# EAGLE board ems_mbed (EAGLE 6.3)
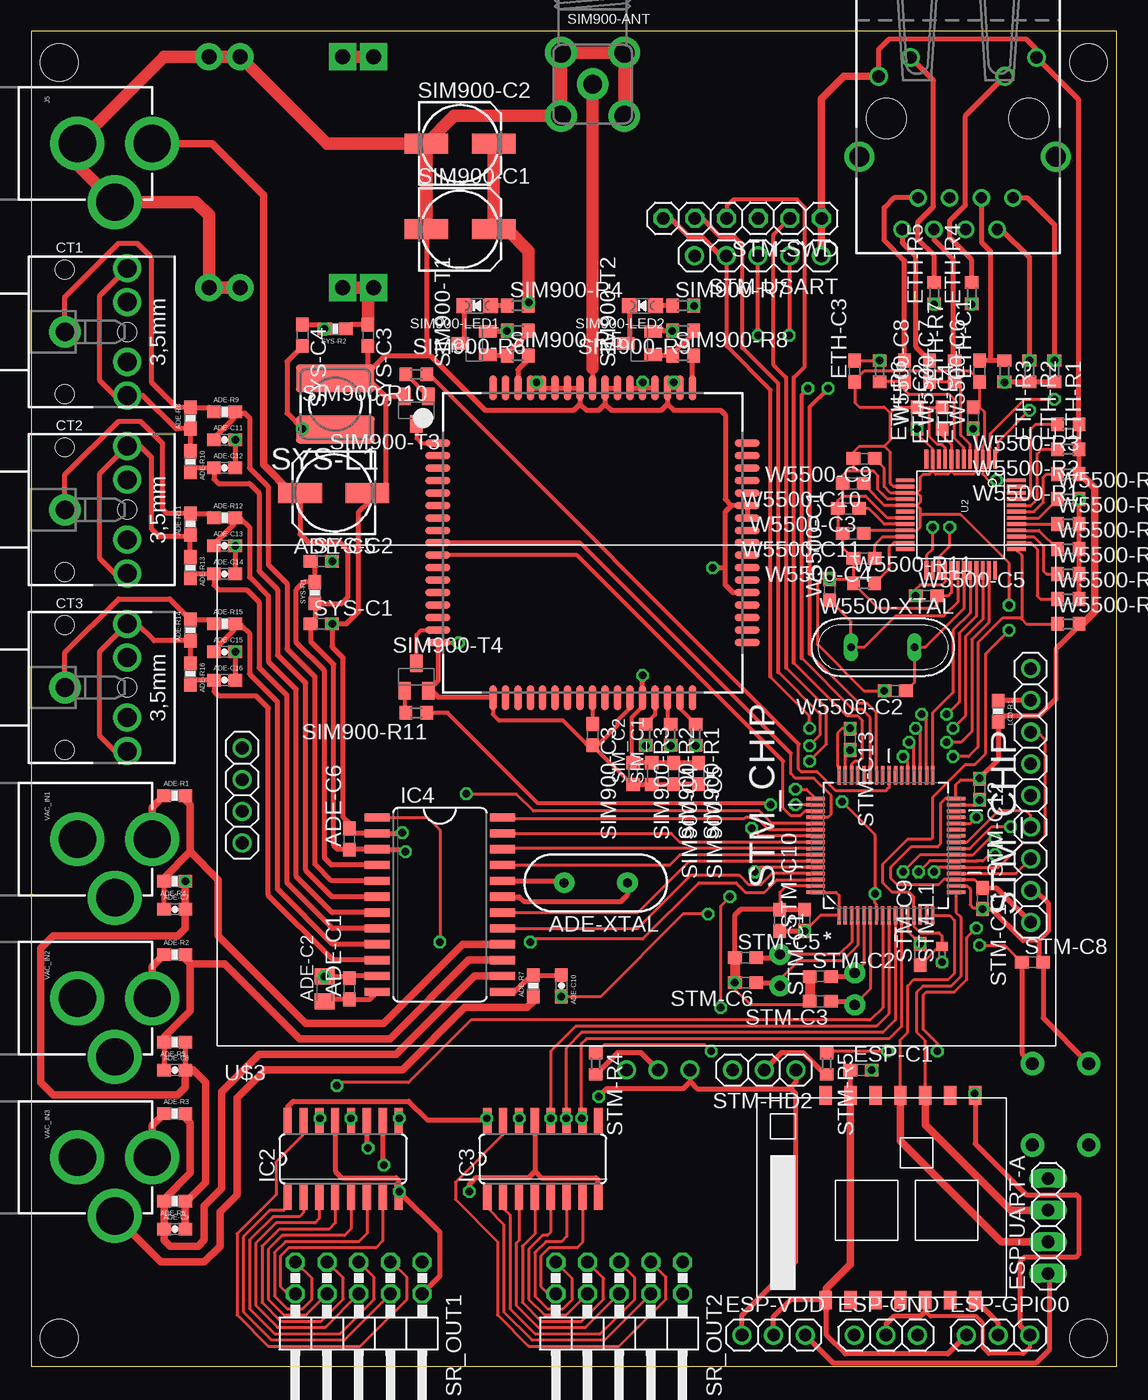
[diagram p2: board, top side]
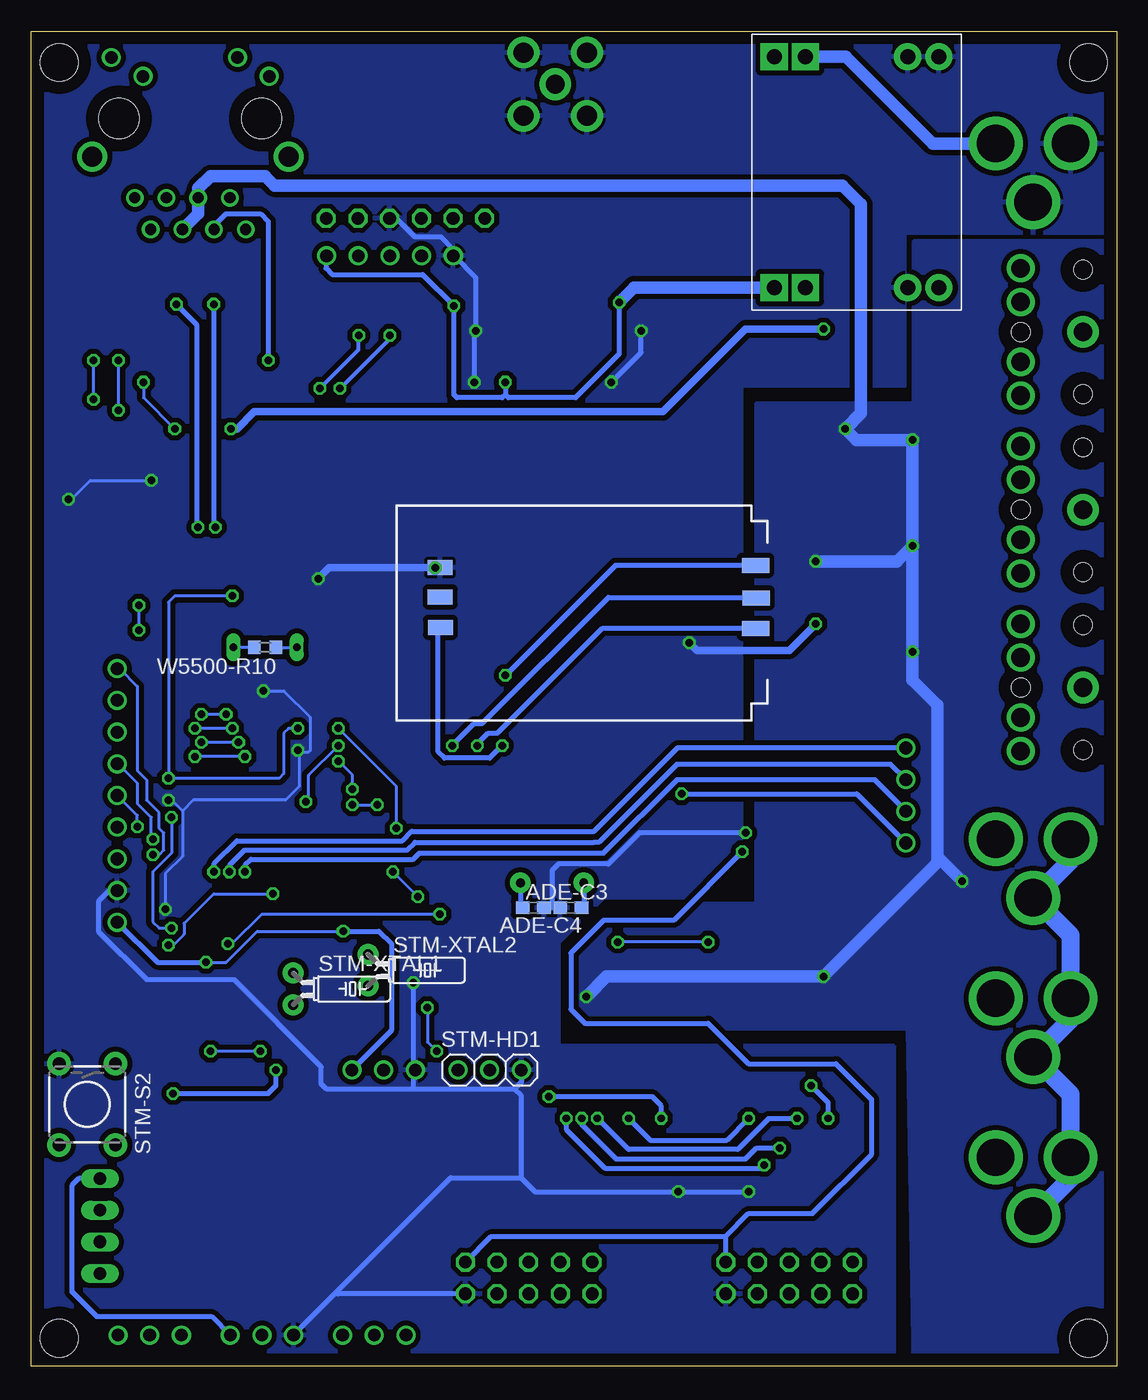
[diagram p3: board, bottom side, seen from below]

Size 87 x 107 mm. Coordinates in mm from the lower left corner, seen from the top.
Outline: 87,0 87,107 0,107 0,0 87,0
Copper layers (1*16): Top 0.035mm / dielectric 1.5mm / Bottom 0.035mm
Design rules "default": minimum track width 10mil, minimum drill 24mil, track to track 8mil, track to pad 8mil, pad to pad 8mil, via to via 8mil, smd to smd 8mil, copper to edge 40mil, drill to drill 8mil, minimum pad ring 10mil, minimum via ring 8mil, stop-mask expansion 4mil, vias tented up to drill 0mil, thermal gap 10mil
Net classes: 1 power: width 0.305 mm, drill 0.6 mm, clearance 0.254 mm; 2 gnd: width 0.254 mm, drill 0.6 mm, clearance 0.254 mm
Holes 3 mm at 2.25,2.25 84.75,2.25 2.25,104.5 84.75,104.5

## Footprints (pad centres in the part's own frame; a part is rotated, then mirrored left to right if it is on the bottom)
C0603 = smd 1.1 x 1: 1 -0.85,0; 2 0.85,0
C0805K = smd 1.3 x 1.6: 1 -1,0; 2 1,0
153CLV-0605 = smd 3.5 x 1.6: + 2.7,0; - -2.7,0
0603-CAP = smd 1.1 x 1: 1 -0.85,0; 2 0.85,0
0603-RES = smd 1.1 x 1: 1 -0.85,0; 2 0.85,0
HC49US = drill 0.7 pad 1.651: 1 -2.54,0; 2 2.54,0
STX3100 = drill 1.5 pad 2.54: 1 2.7,-0.1 | drill 1.5: 2 7.7,5; 3 7.7,2.3; 4 7.7,-2.5; 5 7.7,-5.2 | hole 1.5: 2.7,4.9; 2.7,-5.1; 7.7,-0.1
DCDCMODULE-SMALL = drill 1.2 pad 2.184: INM#1 1.8,15; INM#2 1.8,12.5; OUTM#1 20.3,15; OUTM#2 20.3,12.5 | drill 1.2 pad 2.184 square: INP#1 1.8,4.3; INP#2 1.8,1.8; OUTP#1 20.3,4.3; OUTP#2 20.3,1.8
ESP-07 = smd 1 x 1.5: ANT -5.59,10.47; CH_PD -3.59,10.47; GND 6.41,10.47; GPIO0 6.41,-5.93; GPIO2 4.41,-5.93; GPIO11 -3.59,-5.93; GPIO12 -1.59,-5.93; GPIO13 0.41,-5.93; GPIO15 2.41,-5.93; GPIO16 -1.59,10.47; NC 4.41,10.47; URXD 0.41,10.47; UTXD 2.41,10.47; VCC -5.59,-5.93
1X03 = drill 1.016: 1 -2.54,0; 2 0,0; 3 2.54,0
1X04 = drill 1.016 long: 1 -3.81,0; 2 -1.27,0; 3 1.27,0; 4 3.81,0
R0603 = smd 1 x 1.1: 1 -0.85,0; 2 0.85,0
RJ45_PULSEJACK = drill 0.9: 1 4.445,-6.35; 2 3.175,-8.89; 3 1.905,-6.35; 4 0.635,-8.89; 5 -0.635,-6.35; 6 -1.905,-8.89; 7 -3.175,-6.35; 8 -4.445,-8.89 | drill 1: 9 6.325,4.9; 10 3.785,3.38; 11 -3.785,4.9; 12 -6.325,3.38 | drill 1.6: P$5 -7.875,-3.05; P$6 7.875,-3.05 | hole 3.2: -5.715,0; 5.715,0
SIM900_SMT = smd 2 x 0.6: P$1 -12.4,8; P$2 -12.4,7; P$3 -12.4,6; P$4 -12.4,5; P$5 -12.4,4; P$6 -12.4,3; P$7 -12.4,2; P$8 -12.4,1; P$9 -12.4,0; P$10 -12.4,-1; P$11 -12.4,-2; P$12 -12.4,-3; P$13 -12.4,-4; P$14 -12.4,-5; P$15 -12.4,-6; P$16 -12.4,-7; P$17 -12.4,-8; P$35 12.4,-8; P$36 12.4,-7; P$37 12.4,-6; P$38 12.4,-5; P$39 12.4,-4; P$40 12.4,-3; P$41 12.4,-2; P$42 12.4,-1; P$43 12.4,0; P$44 12.4,1; P$45 12.4,2; P$46 12.4,3; P$47 12.4,4; P$48 12.4,5; P$49 12.4,6; P$50 12.4,7; P$51 12.4,8 | smd 0.6 x 2: P$18 -8,-12.4; P$19 -7,-12.4; P$20 -6,-12.4; P$21 -5,-12.4; P$22 -4,-12.4; P$23 -3,-12.4; P$24 -2,-12.4; P$25 -1,-12.4; P$26 0,-12.4; P$27 1,-12.4; P$28 2,-12.4; P$29 3,-12.4; P$30 4,-12.4; P$31 5,-12.4; P$32 6,-12.4; P$33 7,-12.4; P$34 8,-12.4; P$52 8,12.4; P$53 7,12.4; P$54 6,12.4; P$55 5,12.4; P$56 4,12.4; P$57 3,12.4; P$58 2,12.4; P$59 1,12.4; P$60 0,12.4; P$61 -1,12.4; P$62 -2,12.4; P$63 -3,12.4; P$64 -4,12.4; P$65 -5,12.4; P$66 -6,12.4; P$67 -7,12.4; P$68 -8,12.4
SO16 = smd 0.66 x 2.032: 1 -4.445,-3.073; 2 -3.175,-3.073; 3 -1.905,-3.073; 4 -0.635,-3.073; 5 0.635,-3.073; 6 1.905,-3.073; 7 3.175,-3.073; 8 4.445,-3.073; 9 4.445,3.073; 10 3.175,3.073; 11 1.905,3.073; 12 0.635,3.073; 13 -0.635,3.073; 14 -1.905,3.073; 15 -3.175,3.073; 16 -4.445,3.073
SOIC24 = smd 0.66 x 2.032: 1 -6.985,-5.029; 2 -5.715,-5.029; 3 -4.445,-5.029; 4 -3.175,-5.029; 5 -1.905,-5.029; 6 -0.635,-5.029; 7 0.635,-5.029; 8 1.905,-5.029; 9 3.175,-5.029; 10 4.445,-5.029; 11 5.715,-5.029; 12 6.985,-5.029; 13 6.985,5.029; 14 5.715,5.029; 15 4.445,5.029; 16 3.175,5.029; 17 1.905,5.029; 18 0.635,5.029; 19 -0.635,5.029; 20 -1.905,5.029; 21 -3.175,5.029; 22 -4.445,5.029; 23 -5.715,5.029; 24 -6.985,5.029
POWER_JACK_PTH = drill 2.997 pad 4.318: GND 0,7.7; GNDBREAK 4.7,10.7; PWR 0,13.7
SMA90_DIP = drill 1.5 pad 2.54: ANTENNA 0,0 | drill 1.6 pad 2.54: GND1 -2.54,2.54; GND2 2.54,2.54; GND3 -2.54,-2.54; GND4 2.54,-2.54
CHIPLED_0805_NOOUTLINE = smd 1.2 x 1.2: A 0,-1.05; C 0,1.05
SOT23-BEC = smd 1 x 1.4: B -0.95,-1.1; C 0,1.1; E 0.95,-1.1
C0603K = smd 1.05 x 1.08: 1 -0.875,0; 2 0.875,0
SIMHOLDER3 = smd 2.2 x 1.2: 1 0.95,4.81; 2 0.91,7.41; 3 0.95,9.86 | smd 2 x 1.2: 4 26.2,9.78; 5 26.22,7.34; 6 26.22,4.98
2X05/90 = drill 1.016 octagon: 1 -5.08,-6.35; 2 -5.08,-3.81; 3 -2.54,-6.35; 4 -2.54,-3.81; 5 0,-6.35; 6 0,-3.81; 7 2.54,-6.35; 8 2.54,-3.81; 9 5.08,-6.35; 10 5.08,-3.81
0402 = smd 0.7 x 0.9: 1 -0.65,0; 2 0.65,0
TACTILE-PTH = drill 1.016 pad 1.88: 1 -3.251,2.261; 2 3.251,2.261; 3 -3.251,-2.261; 4 3.251,-2.261
1X06 = drill 1.016 octagon: 1 -6.35,0; 2 -3.81,0; 3 -1.27,0; 4 1.27,0; 5 3.81,0; 6 6.35,0
PINHD5 = drill 1.016: 1 -5.08,0; 2 -2.54,0; 3 0,0; 4 2.54,0; 5 5.08,0
TC26H = drill 0.813 pad 1.676: 1 -1.27,0; 2 1.27,0
QFP50P1200X1200X160-64N = smd 1.473 x 0.279: 1 -5.613,3.759; 2 -5.613,3.251; 3 -5.613,2.743; 4 -5.613,2.261; 5 -5.613,1.753; 6 -5.613,1.245; 7 -5.613,0.762; 8 -5.613,0.254; 9 -5.613,-0.254; 10 -5.613,-0.762; 11 -5.613,-1.245; 12 -5.613,-1.753; 13 -5.613,-2.261; 14 -5.613,-2.743; 15 -5.613,-3.251; 16 -5.613,-3.759; 33 5.613,-3.759; 34 5.613,-3.251; 35 5.613,-2.743; 36 5.613,-2.261; 37 5.613,-1.753; 38 5.613,-1.245; 39 5.613,-0.762; 40 5.613,-0.254; 41 5.613,0.254; 42 5.613,0.762; 43 5.613,1.245; 44 5.613,1.753; 45 5.613,2.261; 46 5.613,2.743; 47 5.613,3.251; 48 5.613,3.759 | smd 0.279 x 1.473: 17 -3.759,-5.613; 18 -3.251,-5.613; 19 -2.743,-5.613; 20 -2.261,-5.613; 21 -1.753,-5.613; 22 -1.245,-5.613; 23 -0.762,-5.613; 24 -0.254,-5.613; 25 0.254,-5.613; 26 0.762,-5.613; 27 1.245,-5.613; 28 1.753,-5.613; 29 2.261,-5.613; 30 2.743,-5.613; 31 3.251,-5.613; 32 3.759,-5.613; 49 3.759,5.613; 50 3.251,5.613; 51 2.743,5.613; 52 2.261,5.613; 53 1.753,5.613; 54 1.245,5.613; 55 0.762,5.613; 56 0.254,5.613; 57 -0.254,5.613; 58 -0.762,5.613; 59 -1.245,5.613; 60 -1.753,5.613; 61 -2.261,5.613; 62 -2.743,5.613; 63 -3.251,5.613; 64 -3.759,5.613
POWER-CHOKE_WE-TPC = smd 6.3 x 2.2: 1 0,2.05; 2 0,-2.05
W5500 = smd 1.5 x 0.3: 1 -4.45,2.75; 2 -4.45,2.25; 3 -4.45,1.75; 4 -4.45,1.25; 5 -4.45,0.75; 6 -4.45,0.25; 7 -4.45,-0.25; 8 -4.45,-0.75; 9 -4.45,-1.25; 10 -4.45,-1.75; 11 -4.45,-2.25; 12 -4.45,-2.75; 25 4.45,-2.75; 26 4.45,-2.25; 27 4.45,-1.75; 28 4.45,-1.25; 29 4.45,-0.75; 30 4.45,-0.25; 31 4.45,0.25; 32 4.45,0.75; 33 4.45,1.25; 34 4.45,1.75; 35 4.45,2.25; 36 4.45,2.75 | smd 0.3 x 1.5: 13 -2.75,-4.45; 14 -2.25,-4.45; 15 -1.75,-4.45; 16 -1.25,-4.45; 17 -0.75,-4.45; 18 -0.25,-4.45; 19 0.25,-4.45; 20 0.75,-4.45; 21 1.25,-4.45; 22 1.75,-4.45; 23 2.25,-4.45; 24 2.75,-4.45; 37 2.75,4.45; 38 2.25,4.45; 39 1.75,4.45; 40 1.25,4.45; 41 0.75,4.45; 42 0.25,4.45; 43 -0.25,4.45; 44 -0.75,4.45; 45 -1.25,4.45; 46 -1.75,4.45; 47 -2.25,4.45; 48 -2.75,4.45
TFT_LCD_2.2 = drill 1.016: LCD_CS 31.6,-5.08; LCD_D/C 31.6,0; LCD_GND 31.6,-7.62; LCD_LED 31.6,7.62; LCD_MISO 31.6,10.16; LCD_MOSI 31.6,2.54; LCD_RESET 31.6,-2.54; LCD_SCK 31.6,5.08; LCD_VCC 31.6,-10.16; SD_CS -31.6,-3.81; SD_MISO -31.6,1.27; SD_MOSI -31.6,-1.27; SD_SCK -31.6,3.81
QS = drill 0.61 long: 1 -2.54,0; 2 2.54,0

## Placement (x,y rotation side)
ADE-C1  0.1uF  [C0603]  25.5,30.25 90 top
ADE-C2  10uF  [C0805K]  23.5,30.25 90 top
ADE-C3  22pF  [C0603]  46.75,36.75 0 bottom
ADE-C4  22pF  [C0603]  43.75,36.75 180 bottom
ADE-C5  10uF  [153CLV-0605]  24.25,70 180 top
ADE-C6  0.1uF  [C0603]  25.5,42.25 90 top
ADE-C7  33nF  [0603-CAP]  11.5,36.62 0 top
ADE-C8  33nF  [0603-CAP]  11.5,23.75 0 top
ADE-C9  33nF  [0603-CAP]  11.5,11 0 top
ADE-C10  33nF  [0603-CAP]  42.5,30.5 270 top
ADE-C11  33nF  [0603-CAP]  15.5,74.25 0 top
ADE-C12  33nF  [0603-CAP]  15.5,72 0 top
ADE-C13  33nF  [0603-CAP]  15.5,65.75 0 top
ADE-C14  33nF  [0603-CAP]  15.5,63.5 0 top
ADE-C15  33nF  [0603-CAP]  15.5,57.25 0 top
ADE-C16  33nF  [0603-CAP]  15.5,55 0 top
ADE-R1  81K  [0603-RES]  11.5,45.75 0 top
ADE-R2  81K  [0603-RES]  11.5,33 0 top
ADE-R3  81K  [0603-RES]  11.5,20.25 0 top
ADE-R4  1K  [0603-RES]  11.5,38.88 180 top
ADE-R5  1K  [0603-RES]  11.5,26 180 top
ADE-R6  1K  [0603-RES]  11.5,13.25 180 top
ADE-R7  1K  [0603-RES]  40.25,30.5 90 top
ADE-R8  33R  [0603-RES]  12.75,76 90 top
ADE-R9  1K  [0603-RES]  15.5,76.5 0 top
ADE-R10  1K  [0603-RES]  12.75,72.5 270 top
ADE-R11  33R  [0603-RES]  12.75,67.5 90 top
ADE-R12  1K  [0603-RES]  15.5,68 0 top
ADE-R13  1K  [0603-RES]  12.75,64 270 top
ADE-R14  33R  [0603-RES]  12.75,59 90 top
ADE-R15  1K  [0603-RES]  15.5,59.5 0 top
ADE-R16  1K  [0603-RES]  12.75,55.5 270 top
ADE-XTAL  10MHz  [HC49US]  45.25,38.75 180 top
CT1  100A  [STX3100]  0,83 0 top
CT2  100A  [STX3100]  0,68.75 0 top
CT3  100A  [STX3100]  0,54.5 0 top
DCDC-3.5V  DCDCMODULE_SMALL  [DCDCMODULE-SMALL]  29.25,106.75 270 bottom
ESP8266  ESP-07  [ESP-07]  69.25,11.25 0 top
ESP-C1  100nF  [C0603]  66.5,23.75 0 top
ESP-GND  [1X03]  68.5,2.5 0 top
ESP-GPIO0  [1X03]  77.5,2.5 0 top
ESP-UART-A  [1X04]  81.5,11.25 90 top
ESP-VDD  [1X03]  59.5,2.5 0 top
ETH-C1  22nF  [C0603]  76,79.75 90 top
ETH-C2  6.8nF  [C0603]  70,79.75 270 top
ETH-C3  10nF  [C0603]  66,79.75 90 top
ETH-C4  6.8nF  [C0603]  72,79.75 270 top
ETH-R1  49R9  [R0603]  82,79.75 270 top
ETH-R2  49R9  [R0603]  80,79.75 270 top
ETH-R3  10R  [R0603]  78,79.75 270 top
ETH-R4  330  [R0603]  75.38,86 90 top
ETH-R5  330  [R0603]  72.38,86 90 top
ETH-R6  49R9  [R0603]  68,79.75 270 top
ETH-R7  49R9  [R0603]  74,79.75 90 top
ETHERNET  [RJ45_PULSEJACK]  74.25,100 0 top
IC1  SIM900  [SIM900_SMT]  45,66 0 top
IC2  74HC595D  [SO16]  25,16.62 0 top
IC3  74HC595D  [SO16]  41,16.62 0 top
IC4  ADE7758RW  [SOIC24]  32.75,37 270 top
J5  POWER_JACKPTH  [POWER_JACK_PTH]  -4,98 270 top
LCD-R1  680R  [0603-RES]  77.5,52.5 270 top
SIM900-ANT  [SMA90_DIP]  45,102.75 0 top
SIM900-C1  100uF  [153CLV-0605]  34.38,91.12 0 top
SIM900-C2  100uF  [153CLV-0605]  34.38,98 0 top
SIM900-C3  4u7  [C0603]  45,50.62 270 top
SIM900-C4  100nF  [C0603]  51.5,47.5 270 top
SIM900-C5  22pF  [C0603]  53.5,47.5 270 top
SIM900-LED1  [CHIPLED_0805_NOOUTLINE]  35.75,85 90 top
SIM900-LED2  [CHIPLED_0805_NOOUTLINE]  49,85 90 top
SIM900-R1  22R  [R0603]  53.25,50.62 270 top
SIM900-R2  22R  [R0603]  51.25,50.62 270 top
SIM900-R3  22R  [R0603]  49.25,50.62 270 top
SIM900-R4  680R  [R0603]  39,85 0 top
SIM900-R5  1K  [R0603]  39,81 0 top
SIM900-R6  10K  [R0603]  39,83 180 top
SIM900-R7  680R  [R0603]  52.25,85 0 top
SIM900-R8  1K  [R0603]  52.25,81 0 top
SIM900-R9  10K  [R0603]  52.25,83 180 top
SIM900-R10  120R  [R0603]  30.88,79.5 180 top
SIM900-R11  120R  [R0603]  30.88,52.38 180 top
SIM900-T1  [SOT23-BEC]  35.5,82 90 top
SIM900-T2  [SOT23-BEC]  48.75,82 90 top
SIM900-T3  [SOT23-BEC]  30.88,76.62 180 top
SIM900-T4  [SOT23-BEC]  30.88,55.25 0 top
SIM_C1  100nF  [C0603K]  49.75,47.5 90 top
SIM_C2  22pF  [C0603K]  48.25,47.5 90 top
SIM_HOLDER  SIMHOLDER3  [SIMHOLDER3]  28,69 180 bottom
SR_OUT1  [2X05/90]  26.25,2 180 top
SR_OUT2  [2X05/90]  47.12,2 180 top
STM-C1  1uF  [C0603]  60,35.75 270 top
STM-C2  20pF  [C0603]  63.25,31.25 0 top
STM-C3  20pF  [C0603]  63.25,29.25 180 top
STM-C5  4.3pF  [C0603]  57.25,32.75 0 top
STM-C6  4.3pF  [C0603]  57.25,30.75 180 top
STM-C8  100nF  [C0603]  80.25,32.38 0 top
STM-C9  100nF  [C0603]  71.25,33 90 top
STM-C10  100nF  [C0603]  62,35.75 90 top
STM-C11  100nF  [C0603]  76.25,37.5 270 top
STM-C12  100nF  [C0603]  76,46.25 270 top
STM-C13  100nF  [C0603]  65.62,50.25 270 top
STM-HD1  BOOT0  [1X03]  50.25,23.75 0 bottom
STM-HD2  BOOT1  [1X03]  58.75,23.75 180 top
STM-L1  BLM15HB121SN1  [0402]  73,33 90 top
STM-R4  10k  [R0603]  45.25,24.25 270 top
STM-R5  10k  [R0603]  63.75,24.25 270 top
STM-S2  SWITCH-MOMENTARY-2PTH  [TACTILE-PTH]  82.5,21 270 bottom
STM-SWD  [1X06]  57,92 180 top
STM-USART  USART  [PINHD5]  58.25,89 180 top
STM-XTAL1  8MHz  [TC26H]  66,30.25 270 bottom
STM-XTAL2  32.768kHz  [TC26H]  60,31.75 270 bottom
STM_CHIP  STM32F103RBT6  [QFP50P1200X1200X160-64N]  68.5,41.75 90 top
SYS-C1  0.1uF  [C0603]  23.25,59.5 0 top
SYS-C2  0.1uF  [C0603]  23.25,64.5 0 top
SYS-C3  0.1uF  [C0603]  27,82.62 270 top
SYS-C4  0.1uF  [C0603]  21.75,82.62 270 top
SYS-L1  150Mhz  [POWER-CHOKE_WE-TPC]  24.38,77.12 180 top
SYS-R1  10R  [0603-RES]  22.75,62 90 top
SYS-R2  10R  [0603-RES]  24.38,83.12 180 top
U2  W5500  [W5500]  74.5,68.25 270 top
U$3  TFT_LCD_2.2  [TFT_LCD_2.2]  48.5,45.75 0 top
VAC_IN1  9V  [POWER_JACK_PTH]  -4,42.25 270 top
VAC_IN2  9V  [POWER_JACK_PTH]  -4,29.5 270 top
VAC_IN3  9V  [POWER_JACK_PTH]  -4,16.75 270 top
W5500-C1  18pF  [C0603]  64,62.25 90 top
W5500-C2  18pF  [C0603]  69.25,54.12 180 top
W5500-C3  4.7uF  [C0603]  65.5,68.75 180 top
W5500-C4  10nF  [C0603]  66.75,64.75 180 top
W5500-C5  100nF  [C0603]  71.75,61.75 0 top
W5500-C6  100nF  [C0603]  75.5,76 90 top
W5500-C7  100nF  [C0603]  73,76 90 top
W5500-C8  100nF  [C0603]  71,76 90 top
W5500-C9  100nF  [C0603]  66.75,72.75 180 top
W5500-C10  100nF  [C0603]  65.88,70.75 180 top
W5500-C11  100nF  [C0603]  65.88,66.75 180 top
W5500-R1  10k  [R0603]  83.12,71.5 180 top
W5500-R2  10k  [R0603]  83.12,73.5 180 top
W5500-R3  10k  [R0603]  83.12,75.5 180 top
W5500-R4  10k  [R0603]  83.12,69.5 0 top
W5500-R5  10k  [R0603]  83.12,67.5 0 top
W5500-R6  10k  [R0603]  83.12,65.5 0 top
W5500-R7  10k  [R0603]  83.12,63.5 0 top
W5500-R8  10k  [R0603]  83.12,61.5 0 top
W5500-R9  10k  [R0603]  83.12,59.5 0 top
W5500-R10  1M  [R0603]  68.25,57.62 180 bottom
W5500-R11  10k  [R0603]  66.75,62.75 0 top
W5500-XTAL  25MHz  [QS]  68.25,57.62 0 top

## Tracks (layer width: path | path; a pad name or v marks a point on that pad's centre or on a via)
+5V  (via drill 0.6)
  Top 0.406: 25.55,41.45 24.55,41.45 24.25,41.75 24.25,56.25 22.4,58.1 SYS-C1.1 22.75,59.85 SYS-R1.1 24.9,61.15 25.38,61.62 25.38,65.38 24.75,66 22.25,66 21.55,66.7 ADE-C5.+ | 25.55,41.45 IC4.3 29.8,41.45 v30,41.25 | 25.55,41.45 ADE-C6.1
  Top 0.61: ADE-C5.+ 20.88,70 18.62,72.25 18.62,93.88 14.5,98 J5.PWR
  Top 1.016: DCDC-3.5V.INP#2 DCDC-3.5V.INP#1
  Bottom 0.406: v30,41.25 35.5,35.75 41.12,35.75 43.75,33.12 43.75,28.62 42.62,27.5 32.75,27.5 29.5,24.25 22.5,24.25 19.62,21.38 19.62,17 24.38,12.25 29.5,12.25 31.33,10.42 | SR_OUT1.1 31.33,10.42 | 31.33,10.42 31.38,10.38 50.18,10.38 SR_OUT2.1
  Bottom 1.016: DCDC-3.5V.INP#1 21.7,104.95 14.75,98 J5.PWR
ACTLED  (via drill 0.6)
  Top 0.254: U2.27 72.75,64.88 73.62,65.75 v73.62,67.25
  Top 0.406: ETH-R4.1 v75.38,85.12
  Bottom 0.406: v75.38,85.12 73.75,83.5 73.75,67.38 v73.62,67.25
ADE_APCF  (via drill 0.6)
  Top 0.254: IC4.1 31.77,43.98 32.75,43 v32.75,34 | v40,34 40.25,34.25 49,34.25 53.5,38.75 56.5,38.75 57.25,38 58.75,38 59.75,39 STM_CHIP.62
  Bottom 0.254: v32.75,34 v40,34
ADE_CS
  Top 0.254: STM_CHIP.58 51.99,40.99 51.17,40.17 IC4.21
ADE_IRQ
  Top 0.254: IC4.18 48.62,36.37 52.75,40.5 STM_CHIP.59
ADE_MISO
  Top 0.254: 37.79,44 IC4.24 37.89,43.88 57.12,43.88 57.25,44 58.12,44 59.13,42.99 STM_CHIP.54
ADE_MOSI
  Top 0.254: STM_CHIP.57 37.83,41.5 IC4.22
ADE_SCK
  Top 0.254: IC4.23 51.28,42.72 52,42 STM_CHIP.56
ADE_VARCF
  Top 0.254: IC4.17 48.59,35.09 52.88,39.38 56.75,39.38 57.5,38.62 58.5,38.62 59.38,39.5 59.39,39.49 STM_CHIP.61
AGND  (via drill 0.6)
  Top 0.254: STM_CHIP.12 70.25,34.85 STM-C9.2 v71.25,33.88 | v54.25,36.25 52.25,36.25 45.62,29.62 v42.5,29.62 ADE-C10.2 | v16.38,65.75 ADE-C13.2 | v12.38,38.88 ADE-R4.1
  Top 0.406: ADE-C16.2 ADE-C15.2 v16.38,57.25 | ADE-C13.2 ADE-C14.2 | ADE-C12.2 ADE-C11.2 v16.38,74.25 | ADE-R5.1 ADE-C8.2 | IC4.11 25.69,31.29 ADE-C1.2 25.35,31.25 ADE-C2.2 | SYS-L1.1 21.75,75.08 v21.75,75.12 20.5,76.38 20.5,80.53 SYS-C4.2 | v24.12,64.5 SYS-C2.2
  Top 0.61: ADE-R4.1 ADE-C7.2 12.35,35.1 11.75,34.5 1.75,34.5 0.75,33.5 0.75,22.75 1.75,21.75 11.75,21.75 12.35,22.35 ADE-C8.2 13,23.75 14,22.75 14,14.75 12.5,13.25 ADE-R6.1 ADE-C9.2
  Bottom 0.254: v71.25,33.88 70.88,33.88 68.5,36.25 v54.25,36.25
  Bottom 0.406: v42.5,29.62 42.38,29.62
  Bottom 0.61: ETHERNET.5 73.6,93.65
  Bottom 1.016: ETHERNET.5 73.61,92.38 ETHERNET.4 | 73.6,93.65 73.6,94.4 72.62,95.38 68.25,95.38 67.5,94.62 22,94.62 20.5,93.12 20.5,76.38 v21.75,75.12 20.88,74.25 v16.38,74.25 v16.38,65.75 | v16.38,65.75 v16.38,57.25 16.38,55 14.38,53 14.38,40.88 | v24.12,64.5 17.62,64.5 v16.38,65.75 | 14.38,40.88 v12.38,38.88 | 14.38,40.88 14.38,40.38 ADE-C2.2 40.88,31.25 v42.5,29.62
  other vias: 23.5,31.25
  pour Bottom (isolate 0.406): -0.38,90.12 16.25,90.12 16.25,77.12 28.88,77.12 28.88,37 44.5,37 44.5,27.12 16.75,27.12 16.25,-0.25 -0.38,-0.25
AVDD
  Top 0.406: IC4.4 24.08,40.17 23.5,40.75 23.5,55.75 21.25,58 21.25,62.25 21.85,62.85 SYS-R1.2 22.75,64.15 SYS-C2.1
BOOT0  (via drill 0.6)
  Top 0.254: STM_CHIP.60 58.37,40 v58,39.62 | v55.25,28.75 55.25,36.88 v56,37.62 | v54.5,25.25 54,25.75 45.9,25.75 STM-R4.1
  Bottom 0.254: v58,39.62 v56,37.62 | v55.25,28.75 55.25,26 v54.5,25.25
BOOT1  (via drill 0.6)
  Top 0.254: STM_CHIP.28 75.25,43.5 v75.75,44 | STM-R5.1 63.85,25.1 | 64.03,25.38 STM-R5.1 | v68.62,25.25 63.9,25.25 STM-R5.1 | v72.62,25.25 72.62,25.88 71.5,27 71.5,29.75 71.75,30 74,30 75,31 75,34.38 v75.75,35.12
  Bottom 0.254: v68.62,25.25 v72.62,25.25 | v75.75,44 75.75,41.12 77.25,39.62 77.25,35.62 76.75,35.12 v75.75,35.12
DGND  (via drill 0.6)
  Top 0.254: STM_CHIP.18 75,38.5 75.25,38.25 75.25,37 75.5,36.75 76.15,36.75 STM-C11.2 v76.25,36.62 | STM_CHIP.31 75.6,45 STM-C12.2 v76,45.38 | STM_CHIP.63 60.5,38.5 60,38 STM-C1.1 | U2.14 69.12,70.5 68.88,70.75 68.88,73.25 68.38,73.75 | U2.16 68.62,69.5 67.88,70.25 67.88,71.38 67.5,71.75 65.88,71.75 | U2.19 68.62,68 66.88,69.75 65,69.75 | 68.38,73.75 66.38,73.75 65.9,73.28 W5500-C9.2 65.9,71.78 65.88,71.75 | 65,69.75 64.65,69.4 W5500-C3.2 64.65,67.12 W5500-C11.2 65.03,65.62 W5500-C4.2 W5500-R11.1 | U2.29 73.75,62 73.5,61.75 W5500-C5.2 72.6,60.98 72.38,60.75 67.9,60.75 W5500-R11.1 | STM_CHIP.47 65.25,49.02 STM-C13.2 v65.62,49.38 | STM-C6.2 56.4,30.23 57.62,29 62.15,29 | 65,69.75 65.03,69.78 W5500-C10.2 65.03,71.4 65.38,71.75 65.88,71.75 | U2.9 73.25,73.62 73,73.88 72.62,73.88 72,74.5 72,76.85 | 72,76.85 W5500-C8.2 70.97,76.88 69.38,76.88 68.88,76.38 | 72,76.85 W5500-C7.2 | W5500-C6.2 76.03,76.85 | 76.03,76.85 76.38,76.5 76.38,73.88 76.25,73.75 U2.3 76.25,71.5 76.75,71 v77.38,71 U2.48 | 76.03,76.85 76,76.88 ETH-C1.1 76,79 75.25,79.75 66.75,79.75 66,79 ETH-C3.1 66,77.25 66.38,76.88 68.38,76.88 68.88,76.38 | 68.38,73.75 68.88,74.25 68.88,76.38 | W5500-R11.1 65.55,63.1 W5500-C1.2 63.35,63.1 63,62.75 63,57.88 66.75,54.12 v68.38,54.12 W5500-C2.2 | v84,69.5 W5500-R4.2
  Top 0.305: IC1.P$29 48,52.75 47,51.75 47,51.38 45.5,49.88 45,49.88 | 45,49.88 SIM900-C3.2 48.02,46.75 SIM_C2.1 | IC1.P$18 37,52.25 37.5,51.75 42.62,51.75 44.5,49.88 45,49.88 | IC1.P$17 v34.25,58
  Top 0.406: IC2.13 24.37,15.63 24.88,15.12 29.25,15.12 29.45,14.93 29.45,14.12 | IC2.8 29.45,14.12 | IC3.13 40.37,15.63 | IC3.8 45.45,14.93 45.25,15.12 40.88,15.12 40.37,15.63 | 40.37,15.63 40.37,15.62 39.88,15.12 35.62,15.12 35.12,14.62 v35.12,14 | 29.45,14.12 29.57,14.25 v29.5,14 32.75,10.75 32.75,7.25 31.33,5.83 SR_OUT1.2 | STM-C10.2 STM-C1.1 56.85,36.6 56.38,36.12 56.38,32.77 STM-C5.1 | 49.77,46.77 SIM_C1.1 | IC1.P$65 40.5,78.4 | 40.5,78.4 IC1.P$64 IC1.P$63 IC1.P$62 IC1.P$61 44,77.12 | IC1.P$58 IC1.P$59 46,77.12 | IC1.P$45 IC1.P$46 56.12,69 | 51,77.12 IC1.P$54 51.5,78.4 | IC1.P$39 56.25,62 55.62,62.62 55.62,64 | IC1.P$17 32.6,54.92 SIM900-T4.E 32.1,54.15 32.62,53.62 36.98,53.62 IC1.P$18 | SIM900-C5.2 SIM900-C4.2 51.48,46.62 SIM_C1.1 | SIM_C2.1 SIM_C1.1 | SIM900-R9.2 v51.38,83 49.9,83 SIM900-T2.E | SIM900-T1.E 38.1,82.95 SIM900-R6.2 v38.12,83 | SYS-L1.2 26.95,79.17 27,79.12 | 27,79.62 SYS-C3.2 | 62.15,29 STM-C3.2 | U$3.LCD_GND 80.5,38.13 81.5,37.12 81.5,34.88 80.75,34.12 | 80.75,34.12 79.5,34.12 77,36.62 76.28,36.62 STM-C11.2 | 80.75,34.12 80.75,32.73 STM-C8.2 81.1,27.91 STM-S2.3 | STM-C6.2 v56.38,30.75 | W5500-R4.2 W5500-R5.2 W5500-R6.2 W5500-R7.2 W5500-R8.2 | SIM900-T3.E 28.4,77.72 | 28.4,77.72 28.4,70.28 28.12,70 ADE-C5.- 26.95,69.2 26.25,68.5 26.25,60.5 25.25,59.5 v24.12,59.5 SYS-C1.2 24.1,57.65 25,56.75 25,44 25.5,43.5 ADE-C6.2 25.88,42.72 IC4.2 29.72,42.72 v29.75,42.75 | IC1.P$53 51.98,78.4 | 51.98,78.4 51.5,78.4 | 51.98,78.4 52,78.38 | v51.5,78.88 51.5,78.4 | v40.5,78.88 40.5,78.4 | 27,79.12 27,79.62 | 27,79.62 28.38,81 31.62,81 | 31.62,81 32,81 36.38,76.62 43.5,76.62 44,77.12 | 28.4,77.72 27,79.12
  Top 0.406: SIM900-C1.- 31.67,81.05 31.62,81 | 44,77.12 44.5,76.62 45.5,76.62 46,77.12 | 46,77.12 46.5,76.62 50.5,76.62 51,77.12 | 51,77.12 51.5,76.62 55.25,76.62 55.62,76.25 55.62,69.5 56.12,69 | 56.12,69 55.62,68.5 55.62,64 | v54.62,64 55.62,64
  Top 0.61: v64,63.12 W5500-C1.2
  Top 0.813: STM-C5.1 STM-C6.2 | STM-C2.1 STM-C3.2
  Top 1.016: SIM900-ANT.GND4 SIM900-ANT.GND2 SIM900-ANT.GND1 SIM900-ANT.GND3 33.88,100.21 SIM900-C2.- | SIM900-C2.- SIM900-C1.- | DCDC-3.5V.OUTM#2 DCDC-3.5V.OUTM#1 14.25,92.25 13.2,93.3 J5.GNDBREAK 3.7,96.3 J5.GND 10.65,104.95 DCDC-3.5V.INM#1 DCDC-3.5V.INM#2 23.7,98 SIM900-C2.-
  Bottom 0.254: v77.38,71 82.25,71 83.75,69.5 v84,69.5 | v76,45.38 75.75,45.38 74.88,44.5 | 74.88,44.5 74.88,40.88 76.25,39.5 v76.25,36.62 | 74.88,44.5 74,45.38 66.62,45.38 65.5,46.5 65.5,49.25 | 65.5,49.25 64.75,49.25 64.62,49.38 64.62,52 66.75,54.12 v68.38,54.12 | 65.5,49.25 v65.62,49.38
  Bottom 0.406: v29.5,14 v35.12,14 46.62,14 47.75,15.12 | ADE-C4.2 45.38,36.75 | 45.38,36.75 ADE-C3.2 | SIM_HOLDER.6 54.6,64.02 v54.62,64 | 56.25,22.25 63.38,22.25 63.75,22.62 63.75,24 70.75,31 77.75,31 81.62,34.88 81.62,37.25 80.75,38.12 U$3.LCD_GND | 56.25,22.25 48.25,22.25 | STM-HD1.3 47.71,22.79 48.25,22.25 | 48.25,22.25 47.75,21.75 47.75,15.12 | v56.38,30.75 56.38,23.75 | 56.38,23.75 56.38,22.38 56.25,22.25 | STM-HD2.3 56.38,23.75 | STM-SWD.3 57.75,92 56.25,90.5 54.12,90.5 53.17,89.55 STM-USART.5 53.12,89 51.38,87.25 v51.38,83 51.5,82.88 v51.5,78.88 | v40.5,78.88 38.12,81.25 v38.12,83 | v29.75,42.75 38.25,42.75 40.75,40.25 44.75,40.25 45.25,39.75 45.25,36.88 45.38,36.75 | 47.75,15.12 53.38,15.12 62.56,5.94 | ESP-GND.1 65.96,2.54 62.56,5.94 | SR_OUT2.2 62.44,5.81 62.56,5.94
  Bottom 0.61: v64,63.12 63.12,64 v54.62,64 | v24.12,59.5 26.25,57.38 33.62,57.38 v34.25,58
  pour Bottom (isolate 0.406): 0,107.38 0,107.5 87.5,107.5 87.5,-0.38 17.88,-0.38 17.88,25.62 18,25.62 44.75,25.62 44.75,34 41.12,37.62 30.12,37.62 30.12,78.62 17,78.62 17,90.88 0,90.88
ESP_GPIO0
  Top 0.406: ESP-GPIO0.2 77.5,3.48 ESP8266.GPIO0
ESP_RX
  Top 0.254: ESP8266.URXD 69.66,26.16 70.25,26.75 70.25,30.5 70.75,31 73.5,31 74,31.5 74,35.75 73.61,36.14 STM_CHIP.16
  Top 0.61: ESP8266.URXD 69.66,18.09 77.75,10 81.48,10 ESP-UART-A.2
ESP_TX
  Top 0.254: STM_CHIP.17 74.11,36.39 74.5,36 74.5,31.25 73.75,30.5 71.5,30.5 71,30 71,26.75 71.66,26.09 ESP8266.UTXD
  Top 0.61: ESP8266.UTXD 71.66,19.34 78.5,12.5 81.48,12.5 ESP-UART-A.3
ETH_CS
  Top 0.254: U2.32 75.25,60.38 73.88,59 73.88,54 72.26,52.38 STM_CHIP.33
ETH_MISO  (via drill 0.6)
  Top 0.254: STM_CHIP.35 71.24,50.76 v70.88,51.12 | U2.34 76.25,59.88 74.88,58.5 74.88,52.12 v73.88,51.12
  Bottom 0.254: v70.88,51.12 v73.88,51.12
ETH_MOSI  (via drill 0.6)
  Top 0.254: STM_CHIP.36 70.76,49.61 v70.38,50 | U2.35 76.75,59.62 75.38,58.25 75.38,50.88 74.5,50 v73.38,50
  Bottom 0.254: v70.38,50 v73.38,50
ETH_RSTN  (via drill 0.6)
  Top 0.254: STM_CHIP.37 70.25,48.5 v69.88,48.88 | v73.88,48.88 75.12,48.88 75.88,49.62 75.88,58 77.88,60 79.38,60 | U2.37 78.95,65.42 79.38,65 79.38,60 | 79.38,60 79.38,59.88 79.75,59.5 W5500-R9.1
  Bottom 0.254: v69.88,48.88 v73.88,48.88
ETH_SCK  (via drill 0.6)
  Top 0.254: U2.33 75.75,60.12 74.38,58.75 74.38,53.25 v73.38,52.25 | STM_CHIP.34 71.75,51.87 v71.38,52.25
  Bottom 0.254: v71.38,52.25 v73.38,52.25
GESP  (via drill 0.6)
  Top 0.305: 71.66,4.41 72.07,4 75.75,4 76.25,3.5 76.25,1.5 76.75,1 79.5,1 80.04,1.54 ESP-GPIO0.3
  Top 0.406: ESP8266.GPIO15 71.66,4.41 71.25,4 69.12,4 68.5,3.38 ESP-GND.2 | v67.38,23.75 ESP-C1.2 | v75.62,21.88 75.62,21.75 ESP8266.GND 75.66,17.84 79.75,13.75 83.75,13.75 84,13.5 84,9 83.75,8.75 79.62,8.75 79.25,8.38 79.25,3.29 ESP-GPIO0.3
  Bottom 0.406: v75.62,21.88 68,21.88 67.38,22.5 v67.38,23.75
GEXT
  Bottom 0.406: ESP-UART-A.4 83.19,15.06 83.75,14.5 83.75,6 81.75,4 72.54,4 ESP-GND.3
IBN
  Top 0.406: CT2.5 6.7,63.55 5.5,64.75 5.5,71.55 CT2.2 8.75,73.75 9.62,72.88 9.62,67.12 10.25,66.5 12.65,66.5 ADE-R11.1 ADE-R13.1
ICN
  Top 0.406: ADE-R16.1 ADE-R14.1 9.85,58.15 8.5,59.5 CT3.2 5.5,57.3 5.5,50.5 6.7,49.3 CT3.5
LCD_CS
  Top 0.254: STM_CHIP.20 78.92,39.49 U$3.LCD_CS
LCD_D/C  (via drill 0.6)
  Top 0.254: STM_CHIP.24 75.25,41.5 77,43.25 v78.5,43.25
  Bottom 0.254: v78.5,43.25 78.5,44.15 U$3.LCD_D/C
LCD_LED
  Top 0.406: U$3.LCD_LED 77.52,53.37 LCD-R1.1
LCD_MISO  (via drill 0.6)
  Top 0.254: v77.25,41 76.75,41 76.25,40.5 75.76,40.5 75.75,40.51 STM_CHIP.22 72,40.51 v71.12,39.62
  Bottom 0.254: v77.25,41 76.75,41 76.38,41.38 76.38,42.75 76.75,43.12 76.75,44.38 77.75,45.38 77.75,47 78.5,47.75 78.5,54.5 79.91,55.91 U$3.LCD_MISO
  Bottom 0.406: U$3.SD_MISO 18.12,48.25 35.25,48.25 41.5,42 41.62,42 41.88,42 56.25,42 56.88,41.38 69.88,41.38 71.12,40.12 v71.12,39.62
LCD_MOSI  (via drill 0.6)
  Top 0.254: v77.25,42.25 76.75,42.25 75.49,40.99 STM_CHIP.23 71.24,40.99 v69.88,39.62
  Bottom 0.254: U$3.LCD_MOSI 80.04,48.29 78.5,46.75 78.5,45.12 77.38,44 77.38,42.38 v77.25,42.25
  Bottom 0.406: U$3.SD_MOSI 16.9,44.52 19.38,47 35.25,47 41.12,41.12 55.88,41.12 56.38,40.62 69.38,40.62 69.88,40.12 v69.88,39.62
LCD_RESET
  Top 0.254: STM_CHIP.25 75,42 77.5,44.5 79.75,44.5 80.1,44.15 U$3.LCD_RESET
LCD_SCK  (via drill 0.6)
  Top 0.254: U$3.LCD_SCK 80.67,50.83 81.25,50.25 81.25,42.5 80.75,42 79.5,42 77.5,40 STM_CHIP.21 72.75,40 v72.38,39.62
  Bottom 0.406: U$3.SD_SCK 35.19,49.56 41.88,42.88 56.5,42.88 57.25,42.12 70.5,42.12 72.38,40.25 v72.38,39.62
LINKLED  (via drill 0.6)
  Top 0.254: U2.25 71.75,65 72.25,65.5 v72.25,67.25 | ETH-R5.1 v72.38,85.12
  Bottom 0.406: v72.38,85.12 72.38,67.38 v72.25,67.25
N$1
  Top 0.254: STM_CHIP.3 65.76,34.01 64.75,33 60.02,33 STM-XTAL2.1
  Top 0.406: STM-C5.2 59.73,32.75 STM-XTAL2.1
N$2
  Top 0.254: STM_CHIP.4 66.25,36.13 66.25,33.75 65,32.5 61.5,32.5 60,31 STM-XTAL2.2
  Top 0.406: STM-C6.1 59.73,30.75 STM-XTAL2.2
N$3
  Top 0.305: IC1.P$31 50,52.23 SIM900-R3.1
N$5
  Top 0.406: STM-HD1.2 48.88,25.12 46.98,25.12 STM-R4.2
N$6
  Top 0.254: STM_CHIP.5 66.75,32.27 STM-XTAL1.1
  Top 0.406: STM-C2.2 65.73,31.25 STM-XTAL1.1
N$7
  Top 0.254: STM_CHIP.6 67.25,30.23 STM-XTAL1.2
  Top 0.406: STM-C3.1 65.73,29.25 STM-XTAL1.2
N$8
  Top 0.305: IC1.P$32 51,51.73 SIM900-R2.1
N$10
  Top 0.61: ADE-R3.2 12.35,19.9 12.75,19.5 12.75,15.5 10.65,13.4 ADE-R6.2 ADE-C9.1 10.65,10.1 11.12,9.62 13.38,9.62 13.88,10.12 13.88,12.88 15.25,14.25 15.25,22 18.25,25 29.25,25 35.53,31.29 IC4.14
N$11
  Top 0.406: ETH-R4.2 75.38,88.69 73.62,90.44 73.62,91.81 74.88,93.06 74.88,100.22 ETHERNET.10
N$12
  Top 0.406: ETH-R5.2 72.38,89 71.06,90.31 71.06,91.69 72.31,92.94 72.31,103.05 ETHERNET.11
N$13
  Top 0.305: IC1.P$33 52,52.73 SIM900-R1.1
N$14
  Top 0.305: IC1.P$26 SIM900-C3.1
N$15
  Top 0.406: 45,80 IC1.P$60
  Top 1.016: SIM900-ANT.ANTENNA 45,80
N$16
  Top 0.406: SIM900-R4.1 SIM900-LED1.A
N$17
  Top 0.406: SIM900-LED1.C 34.7,82.3 SIM900-T1.C
N$18
  Top 0.406: SIM900-T1.B 38.1,81.05 SIM900-R5.1 38.15,81.15 39.85,82.85 SIM900-R6.1
N$19
  Top 0.406: SIM900-R7.1 SIM900-LED2.A
N$20
  Top 0.406: SIM900-LED2.C 47.95,82.3 SIM900-T2.C
N$21
  Top 0.406: SIM900-T2.B 51.35,81.05 SIM900-R8.1 51.4,81.15 53.1,82.85 SIM900-R9.1
N$22
  Top 0.406: ETH-C2.1 70,88.62 68.38,90.25 68.38,92.88 69.15,93.65 ETHERNET.7
N$23
  Top 0.406: 76.16,80.75 ETH-C1.2 76.88,80.6 | ETH-R3.1 76.88,80.6 | ETHERNET.3 76.16,90.09 76.88,89.38 76.88,80.6
N$24
  Top 0.406: 14.75,57.35 ADE-C15.1 14.65,57.4 16.25,59 16.25,59.4 ADE-R15.2 16.35,59.35 16.9,59.35 17.5,58.75 17.5,55.5 19.75,53.25 19.75,38.25 24.17,33.83 IC4.9
N$25
  Top 0.406: CT2.1 2.7,71.45 7,75.75 8.75,75.75 10.5,74 10.5,68.75 10.9,68.35 ADE-R11.2 14.3,68.35 ADE-R12.1
N$26
  Top 0.406: ETHERNET.8 69.81,90.07 70.88,89 70.88,81.72 ETH-C4.1
N$27
  Top 0.254: 16.25,76.4 16.25,76
  Top 0.406: ADE-C11.1 14.65,74.4 16.25,76 | ADE-R9.2 16.25,76.4 17.1,76.4 17.5,76 17.5,72 19,70.5 19,64.25 20.5,62.75 20.5,57.5 22.75,55.25 22.75,40.25 24.09,38.91 IC4.5
N$28
  Top 0.406: ADE-R10.2 13.1,72 ADE-C12.1 14.65,71.1 15,70.75 17.5,70.75 18.25,70 18.25,63.75 19.75,62.25 19.75,57 22,54.75 22,39.75 24.12,37.63 IC4.6
N$29  (via drill 0.6)
  Top 0.254: ETH-C3.2 ETH-R6.1
  Top 0.406: ETH-R7.2 74,81 73.88,81.12 73.88,88.75 72.34,90.28 ETHERNET.6 | ETH-R6.1 v68,80.62
  Bottom 0.406: ETHERNET.6 72.34,91.41 71.38,92.38 68.62,92.38 68,91.75 v68,80.62
N$30
  Top 0.406: ADE-R13.2 13.1,63.5 ADE-C14.1 14.65,62.6 15,62.25 17.25,62.25 18.25,61.25 18.25,56 20.5,53.75 20.5,38.75 24.16,35.09 IC4.8
N$31
  Top 0.406: ADE-C13.1 14.65,65.9 16.25,67.5 16.25,67.9 ADE-R12.2 16.75,68 17.5,67.25 17.5,63.25 19,61.75 19,56.5 21,54.5 21.25,54.25 21.25,39.25 24.13,36.37 IC4.7
N$32
  Top 0.406: IC4.12 27.11,29.4 ADE-C1.1 23.65,29.4 ADE-C2.1
N$33
  Top 0.406: IC4.19 39.12,37.63 39.5,37.25 47.25,37.25 47.79,37.79 ADE-XTAL.1
  Bottom 0.406: ADE-XTAL.1 47.79,36.94 ADE-C3.1
N$34
  Top 0.406: IC4.20 42.55,38.91 ADE-XTAL.2
  Bottom 0.406: ADE-XTAL.2 42.71,36.94 ADE-C4.1
N$35
  Top 0.406: IC4.13 37.79,30 38.75,30 40.1,31.35 ADE-R7.2 ADE-C10.1
N$36
  Top 0.61: VAC_IN2.PWR 9.7,32.05 ADE-R2.1
N$37
  Top 0.406: ADE-R5.2 ADE-C8.1
  Top 0.61: ADE-R2.2 12.35,32.65 12.75,32.25 | 12.75,32.25 12.75,28.5 10.65,26.4 ADE-R5.2 | 12.75,32.25 15.5,32.25 21.5,26.25 28.75,26.25 35.05,32.55 IC4.15
N$38
  Top 0.254: U2.20 68.38,67.5 67.12,68.75 W5500-C3.1
N$39
  Top 0.406: CT1.1 2.7,85.7 7,90 8.5,90 9.62,88.88 9.62,78.88 11.65,76.85 ADE-R8.2 14.3,76.85 ADE-R9.1
N$40
  Top 0.406: ADE-R16.2 13.1,55 ADE-C16.1 14.65,54.1 15,53.75 18,53.75 19,52.75 19,37.75 24.2,32.55 IC4.10
N$41
  Top 0.254: W5500-C4.1 67.6,65.85 68.25,66.5 U2.22
N$42
  Top 0.254: U2.23 69.12,66 68.75,65.62 68.75,63.9 W5500-R11.2
N$44
  Top 0.305: SIM900-R10.2 30.05,79.5 SIM900-T3.B
N$45
  Top 0.305: SIM900-T4.B 29.92,52.48 SIM900-R11.2
N$46
  Top 0.406: STM-R5.2 63.6,23.4 61.88,25.12 60.12,25.12 STM-HD2.2
N$47
  Top 0.406: ADE-R10.1 ADE-R8.1 11.6,75.15 8.95,77.8 CT1.5 6.7,77.8 5.5,79 5.5,85.8 CT1.2
N$48
  Top 0.406: CT3.1 2.7,57.2 7,61.5 11.1,61.5 ADE-R14.2 14.3,59.85 ADE-R15.1
N$49
  Top 0.254: U2.30 74.25,61.25 73.12,60.12 69.25,60.12 66.75,57.62 W5500-XTAL.1 65.71,59.69 W5500-C1.1
  Bottom 0.254: W5500-R10.1 W5500-XTAL.1
N$50
  Top 0.254: U2.31 74.75,60.75 71.62,57.62 W5500-XTAL.2 70.79,54.81 W5500-C2.1
  Bottom 0.254: W5500-R10.2 W5500-XTAL.2
N$52
  Top 0.406: ADE-C7.1 ADE-R4.2
  Top 0.61: ADE-R1.2 12.35,45.4 12.75,45 12.75,41.25 | 12.75,41.25 10.65,39.15 ADE-R4.2 | 12.75,41.25 15,39 15,34.5 22,27.5 28.25,27.5 34.58,33.83 IC4.16
N$54
  Top 0.61: VAC_IN1.PWR 9.7,44.8 ADE-R1.1
N$55
  Top 0.61: ADE-R7.1 40.25,29.25 39.75,28.75 34.75,28.75 29.75,23.75 18.75,23.75 16.5,21.5 16.5,13.75 15.12,12.38 15.12,9.62 13.88,8.38 10.38,8.38 VAC_IN3.GNDBREAK
  Bottom 1.422: VAC_IN1.GND 3.7,40.55 VAC_IN1.GNDBREAK 3.7,34.55 VAC_IN2.GND 3.7,27.8 VAC_IN2.GNDBREAK 3.7,21.8 VAC_IN3.GND 3.7,15.05 VAC_IN3.GNDBREAK
N$57
  Top 0.254: U2.38 80.12,66 80.62,65.5 80.62,61.75 80.88,61.5 W5500-R8.1
N$58
  Top 0.254: U2.39 80.38,66.5 81.12,65.75 81.12,63.75 81.38,63.5 W5500-R7.1
N$59
  Top 0.254: U2.40 80.78,67 W5500-R6.1
N$60
  Top 0.254: U2.41 W5500-R5.1
N$61
  Top 0.254: U2.42 80.78,68 W5500-R4.1
N$62
  Top 0.254: U2.43 80.38,68.5 81.12,69.25 81.12,71.25 81.38,71.5 W5500-R1.2
N$63
  Top 0.254: U2.44 80.12,69 80.62,69.5 80.62,73.12 81,73.5 W5500-R2.2
N$64
  Top 0.254: W5500-R3.2 80.5,75.5 80.12,75.12 80.12,69.75 79.88,69.5 U2.45
N$65
  Top 0.61: VAC_IN3.PWR 9.7,19.3 ADE-R3.1
Q1
  Top 0.254: IC2.15 21.83,18.57 19.62,16.38 19.62,13.75 16.5,10.62 16.5,4.12 19,1.62 26.38,1.62 30.12,5.38 30.12,7.12 28.9,8.35 SR_OUT1.3
Q2
  Top 0.254: 20.56,12.8 20.25,12.5 19.12,12.5 17,10.38 17,4.38 19.25,2.12 25.12,2.12 25.12,2.15 SR_OUT1.4
  Top 0.305: IC2.1 20.56,12.8
Q3
  Top 0.254: IC2.2 21.83,12.32 21.5,12 19.38,12 17.5,10.12 17.5,4.62 19.5,2.62 24.75,2.62 27.5,5.38 27.5,7.12 26.27,8.35 SR_OUT1.5
Q4
  Top 0.254: IC2.3 23.09,11.85 22.75,11.5 19.62,11.5 18,9.88 18,4.88 19.75,3.12 23.59,3.12 23.59,3.15 SR_OUT1.6
Q5
  Top 0.254: IC2.4 24.37,11.49 23.88,11 19.88,11 18.5,9.62 18.5,5.12 20,3.62 23.25,3.62 25,5.38 25,7.08 23.73,8.35 SR_OUT1.7
Q6
  Top 0.254: IC2.5 25.63,11.01 25.12,10.5 20.12,10.5 19,9.38 19,5.38 20.25,4.12 22.05,4.12 22.05,4.14 SR_OUT1.8
Q7
  Top 0.254: IC2.6 26.91,10.65 26.25,10 20.38,10 19.5,9.12 19.5,5.62 20.5,4.62 21.75,4.62 22.5,5.38 22.5,7.04 21.19,8.35 SR_OUT1.9
Q8
  Top 0.254: IC2.7 28.17,10.05 27.62,9.5 20.62,9.5 20,8.88 20,6.38 20.56,5.81 SR_OUT1.10
Q9
  Top 0.254: IC3.15 37.83,18.57 34,14.75 34,13.38 37.38,10 37.38,4.12 39.88,1.62 47.12,1.62 50.88,5.38 50.88,7.14 SR_OUT2.3
Q10
  Top 0.254: 36.55,12.93 36.55,12.7 37.88,11.38 37.88,4.38 40.12,2.12 45.98,2.12 SR_OUT2.4
  Top 0.305: IC3.1 36.55,12.93
Q11
  Top 0.254: IC3.2 37.83,12.68 38.38,12.12 38.38,4.62 40.38,2.62 45.62,2.62 48.38,5.38 48.38,7.1 SR_OUT2.5
Q12
  Top 0.254: IC3.3 39.09,10.1 38.88,9.88 38.88,4.88 40.62,3.12 44.44,3.12 SR_OUT2.6
Q13
  Top 0.254: IC3.4 40.37,10.62 39.38,9.62 39.38,5.12 40.88,3.62 44.12,3.62 45.88,5.38 45.88,7.06 SR_OUT2.7
Q14
  Top 0.254: IC3.5 41.63,10.76 41.38,10.5 41,10.5 39.88,9.38 39.88,5.38 41.12,4.12 42.9,4.12 SR_OUT2.8
Q15
  Top 0.254: IC3.6 42.91,10.4 42.5,10 41.25,10 40.38,9.12 40.38,5.62 41.38,4.62 42.62,4.62 43.38,5.38 43.38,7.02 SR_OUT2.9
Q16
  Top 0.254: IC3.7 44.17,9.93 43.75,9.5 41.5,9.5 40.88,8.88 40.88,6.38 41.44,5.81 SR_OUT2.10
QS  (via drill 0.6)
  Top 0.406: IC2.9 29.45,19.95 v29.5,19.88 | IC3.14 39.09,19.84 v39.12,19.88
  Bottom 0.406: v29.5,19.88 31.25,18.12 37.38,18.12 v39.12,19.88
RXN
  Top 0.254: ETH-C4.2 ETH-R7.1 74.5,78.4 74.5,74.62 75.25,73.88 U2.5
RXP
  Top 0.254: ETH-R6.2 ETH-C2.2 70,78.25 70.38,77.88 73.62,77.88 74,77.5 74,74.38 74.75,73.62 U2.6
SD_CS  (via drill 0.6)
  Top 0.254: STM_CHIP.53 59.37,43.5 58.38,44.5 40.25,44.5 38.88,45.88 v34.88,45.88
  Bottom 0.406: v34.88,45.88 20.83,45.88 U$3.SD_CS
SERIAL_RX  (via drill 0.6)
  Top 0.254: STM_CHIP.43 67.25,51.99 66.62,52.62 65.88,52.62 61.75,56.75
  Top 0.305: 61.75,56.75 61.75,77.88 v62.25,78.38 | v58.25,82.62 STM-USART.3
  Bottom 0.305: v58.25,82.62 58.25,82.38 v62.25,78.38
SERIAL_TX  (via drill 0.6)
  Top 0.254: STM_CHIP.42 67.74,52.39 67,53.12 66.38,53.12 62.38,57.12 | 60.79,82.67 v60.75,82.62
  Top 0.305: v63.88,78.38 62.38,76.88 62.38,57.12 | 60.79,82.67 STM-USART.2
  Bottom 0.254: 60.79,82.58 v60.75,82.62
  Bottom 0.305: 60.79,82.58 60.79,81.46 v63.88,78.38
SIM900_PWRKEY
  Top 0.305: SIM900-T3.C 30.88,74.38 31.25,74 IC1.P$1
SIM900_RESET
  Top 0.305: SIM900-T4.C 30.88,58.62 31.25,59 IC1.P$16
SIM_NETLIGHT
  Top 0.406: IC1.P$52 53,80.9 SIM900-R8.2
SIM_PWRKEY
  Top 0.254: STM_CHIP.40 68.75,46.38 68.5,46.12 64.5,46.12 63,47.62 61.75,47.62 61.5,47.88 61.5,49.88
  Top 0.305: 61.5,49.88 31.88,79.5 SIM900-R10.1
SIM_RESET  (via drill 0.6)
  Top 0.254: STM_CHIP.50 61.63,45 61.62,45 v61.25,45
  Top 0.305: v59.25,45 59.12,45.12 40.62,45.12 33.38,52.38 SIM900-R11.1
  Bottom 0.254: v61.25,45 v59.25,45
SIM_RX
  Top 0.254: STM_CHIP.51 61.99,44.49 61.62,44.12 60.88,44.12 60.25,44.75 60.25,48.5
  Top 0.305: 60.25,48.5 43.75,65 IC1.P$10
SIM_STATUS
  Top 0.406: SIM900-R5.2 39.85,80.72 39,79.88 IC1.P$66
SIM_TX
  Top 0.254: STM_CHIP.52 63.89,44.01 64.12,44.25 64.12,45.75 62.75,47.12 61.25,47.12 60.88,47.5 60.88,49.12
  Top 0.305: IC1.P$9 44,66 60.88,49.12
SR_DS  (via drill 0.6)
  Top 0.254: v24.5,22.5 24.75,22.75 30.25,22.75 35.25,27.75 67.25,27.75 68.25,28.75 STM_CHIP.8
  Top 0.406: IC2.14 23.09,19.84 v23.12,19.88
  Bottom 0.406: v23.12,19.88 23.12,21.12 v24.5,22.5
SR_RST  (via drill 0.6)
  Top 0.254: STM_CHIP.11 69.75,27.25 68.75,26.25 44.5,26.25 44.12,25.88 v44.12,19.88
  Top 0.406: IC3.10 44.17,19.43 v44.12,19.88 | IC2.10 28.17,16.2 v28.25,16.12
  Bottom 0.406: v28.25,16.12 28.5,15.88 41,15.88 44.12,19 v44.12,19.88
SR_SHCP  (via drill 0.6)
  Top 0.254: STM_CHIP.10 69.26,27.76 68.25,26.75 44.12,26.75 42.88,25.5 v42.88,19.88
  Top 0.406: IC3.11 42.91,19.97 v42.88,19.88 | IC2.11 26.88,19.67 26.88,17.62 v27,17.5
  Bottom 0.406: v42.88,19.88 42.88,19.38 40.12,16.62 29.75,16.62 28.88,17.5 v27,17.5
SR_STCP  (via drill 0.6)
  Top 0.254: STM_CHIP.9 68.75,28.25 67.75,27.25 43.62,27.25 41.62,25.25 v41.62,19.88
  Top 0.406: v25.62,19.88 IC2.12 | v41.62,19.88 IC3.12
  Bottom 0.406: v25.62,19.88 27.88,19.88 30.38,17.38 39.12,17.38 39.38,17.62 v41.62,19.88
SWD_NRST  (via drill 0.6)
  Top 0.254: v62.38,49.75 63.25,50.62 63.25,52.25 59.88,55.62 | v76,33.75 78.03,33.75 STM-C8.1 | v65,45.25 67.62,42.62 v67.62,37.88 67.62,37.12 67.74,37.01 STM_CHIP.7
  Top 0.305: 59.88,55.62 59.88,78.75 57,81.62 57,89.88
  Top 0.406: STM-C8.1 79.4,25.09 STM-S2.1 | STM-SWD.5 53.75,92 55.25,90.5 56.38,90.5 57,89.88
  Bottom 0.254: v65,45.25 64.75,45.5 64.75,47.38 v62.38,49.75 | v76,33.75 75.62,33.75 74.75,34.62 74.75,35.5 72.38,37.88 v67.62,37.88
SWD_SWO  (via drill 0.6)
  Top 0.254: STM_CHIP.55 58.36,42.51 v57.75,43.12 | v62.38,51.12 62.38,52.12 59.25,55.25
  Top 0.305: 59.25,55.25 59.25,78.25 55.75,81.75 55.75,88.96 STM-USART.4
  Top 0.406: STM-SWD.6 51.25,92 52.75,90.5 53.75,90.5 55.25,89 STM-USART.4
  Bottom 0.254: v62.38,51.12 57.75,46.5 v57.75,43.12
SWD_TCK  (via drill 0.6)
  Top 0.254: 62.87,45.51 STM_CHIP.49 62.15,46.25 v61.25,46.25 | v62.38,48.5 63.75,49.88 63.75,52.75 60.5,56
  Top 0.305: STM-SWD.2 59.5,90.69 59.5,80.25 60.5,79.25 60.5,56
  Bottom 0.254: v61.25,46.25 61.25,47.38 v62.38,48.5
SWD_TMS
  Top 0.254: STM_CHIP.46 65.76,48.26 66,48.5 66.38,48.5 66.62,48.75 66.62,51.75 66.25,52.12 65.38,52.12 61.12,56.38
  Top 0.305: 61.12,56.38 61.12,79.25 62,80.12 62,92.88 61.38,93.5 56.25,93.5 55.75,93 55.75,92.02 STM-SWD.4
TXN  (via drill 0.6)
  Top 0.254: U2.1 77.25,73.12 77.5,73.38 77.5,74.12 v80,76.62
  Top 0.406: ETHERNET.2 77.77,91.11 80,88.88 v80,80.62 ETH-R2.1
  Bottom 0.254: v80,76.62 v80,80.62
TXP  (via drill 0.6)
  Top 0.254: U2.2 76.75,73.5 76.88,73.62 76.88,74.75 79.62,77.5 v82,77.5
  Top 0.406: ETHERNET.1 79.85,93.65 82,91.5 v82,80.62 ETH-R1.1
  Bottom 0.254: v82,77.5 v82,80.62
USIM_CLK  (via drill 0.6)
  Top 0.406: SIM900-R2.2 v51.25,49.75
  Bottom 0.406: SIM_HOLDER.3 28.97,59.12 41.25,59.12 49.62,50.75 50.38,50.75 51.25,49.88 v51.25,49.75
USIM_DATA  (via drill 0.6)
  Top 0.406: SIM900-R3.2 v49.25,49.75
  Bottom 0.406: v49.25,49.75 50.25,48.75 53.88,48.75 54.38,49.25 54.38,59.05 SIM_HOLDER.4
USIM_RESET  (via drill 0.6)
  Top 0.406: SIM900-R1.2 v53.25,49.75
  Bottom 0.406: SIM_HOLDER.2 28.95,61.62 40.75,61.62 50.88,51.5 51.5,51.5 v53.25,49.75
USIM_VCC  (via drill 0.6)
  Top 0.305: IC1.P$30 49,52.88 48.12,52 48.12,48.5 SIM_C2.2 48.12,48.62
  Top 0.406: 51.48,48.5 SIM900-C4.1 52,48.35 | SIM900-C5.1 52,48.35 | 52,48.35 51.98,48.38 SIM_C1.2 SIM_C2.2 | IC1.P$30 v49,55.38
  Bottom 0.406: SIM_HOLDER.1 40.19,64.19 v49,55.38
VCC  (via drill 0.6)
  Top 0.254: STM-C9.1 72.75,33.65 STM-L1.2 73,34.5 72.75,34.75 71.25,34.75 70.76,35.24 STM_CHIP.13 70.76,37.61 70.38,38 69,38 68.25,38.75 68.25,40.25 70.25,42.25 72.12,42.25 72.25,42.38 72.25,45.62 74.88,48.25 75.62,48.25 76.5,49.12 76.5,57.12 v78.38,59 | W5500-C9.1 68.38,71.97 68.38,70.5 68.88,70 U2.15 71,70 | W5500-C10.1 67,70.47 67,70.38 68.38,69 U2.17 71,69 | W5500-C11.1 66.97,67 U2.21 71,67 71.25,67.25 71.25,68.25 | 71,70 71.25,69.75 71.25,69.25 71,69 | 71.25,68.25 71.25,68.75 71,69 | 72.25,71.75 U2.11 72.25,73.5 71,74.75 v71,75.12 | 72.25,71.75 72.5,71.5 73.5,71.5 73.75,71.75 | 73.75,71.75 U2.8 73.75,73.88 73,74.62 W5500-C7.1 | 73.75,71.75 74,71.5 75.5,71.5 75.75,71.75 U2.4 75.75,74.9 W5500-C6.1 | 71,70 71.25,70.25 71.25,71.25 71.5,71.5 72,71.5 72.25,71.75 | v78.38,61 78.38,64.38 74.5,68.25 71.25,68.25
  Top 0.406: SYS-C4.1 23.17,83.47 SYS-R2.2 | ETH-R1.2 ETH-R2.2 ETH-R3.2 v78,78.88 | W5500-C6.1 v75.5,75.12
  Top 0.61: SYS-R2.2 v23.5,83.12 | W5500-C8.1 v71,75.12
  Bottom 0.254: v78.38,61 v78.38,59 | v78,78.88 78,77.62 v75.5,75.12
  Bottom 0.61: v23.5,83.12 29.75,83.12 36.38,76.5 69.12,76.5 70.5,75.12 v71,75.12
VDD  (via drill 0.6)
  Top 0.254: STM-C11.1 75.59,39.01 STM_CHIP.19 73.13,39.01 72.75,38.62 69.38,38.62 68.88,39.12 68.88,40 70.5,41.62 72.62,41.62 72.88,41.88 72.88,45.12 73.26,45.51 STM_CHIP.32 74.11,46.61 74.5,47 75.9,47 STM-C12.1 v76,47.12 | STM_CHIP.64 64.51,37.99 64.75,37.75 STM_CHIP.1 63.24,36.14 STM-C10.1 | U2.28 73.25,62.88 73,62.62 71.25,62.62 70.9,62.27 W5500-C5.1 v70.88,61.75 | STM_CHIP.48 64.74,48.01 64.62,48.12 64.62,50.75 64.97,51.1 STM-C13.1 v65.62,51.12 | W5500-R9.2 83.97,59.35 | v73,32.38 STM-L1.1
  Top 0.406: IC3.16 36.55,20.45 | IC2.16 20.56,20.8 21,21.25 30.25,21.25 31.75,19.75 36.5,19.75 IC3.16 | STM-C12.1 77.5,48.6 LCD-R1.2 77.97,52.12 80.75,52.12 82.12,53.5 82.12,57.5 83.97,59.35 | STM-C1.2 STM-C10.1 v62,34.88 | IC1.P$55 IC1.P$56 IC1.P$57 48.98,78.4 49,78.38 v49,78.88 | SYS-C3.1 25.58,83.47 SYS-R2.1 | STM-HD1.1 52.79,22.84 | 52.79,22.84 53.38,22.25 60.75,22.25 | STM-HD2.1 61.29,22.79 60.75,22.25 | v36.5,19.88 36.5,19.75 IC3.16 | 52.79,22.84 52.79,22.79 52.25,22.25 46.12,22.25 v45.5,21.62 | 60.75,22.25 60.88,22.25 61.25,21.88 61.25,8.38 56.96,4.08 ESP-VDD.1 | STM-C11.1 77.34,38.35 U$3.LCD_VCC | W5500-R1.1 W5500-R2.1 W5500-R3.1 83.97,101.5 ETHERNET.9 80.58,105.55 79.75,106.38 68.75,106.38 67.92,105.55 ETHERNET.12 | v53.12,85 SIM900-R7.2 | SIM900-R4.2 39.85,85.22 v39.88,85.25 | 38,91.12 SIM900-C1.+
  Top 0.61: STM-USART.1 63.33,91.98 STM-SWD.1 63.35,101.6 65.12,103.38 ETHERNET.12 | W5500-R9.2 84.25,59.5 85.25,60.5 85.25,70.38 84.12,71.5 W5500-R1.1
  Top 1.016: SIM900-C2.+ SIM900-C1.+ | SYS-C3.1 27,86 | DCDC-3.5V.OUTP#1 26.55,86.45 27,86 | 27,86 DCDC-3.5V.OUTP#2 | 38,91.12 38.12,91.12 39.88,89.38 v39.88,85.25
  Bottom 0.254: v73,32.38 71.38,32.38 68.88,34.88 v62,34.88 | v65.62,51.12 66.38,51.12 66.75,50.75 66.75,47.5 67.12,47.12 v76,47.12 76,61.25 75.5,61.75 v70.88,61.75
  Bottom 0.406: v45.5,21.62 37.25,21.62 36.5,20.88 v36.5,19.88 | U$3.LCD_VCC 76.88,32.38 v73,32.38 | v62,34.88 59.12,34.88 58.12,33.88 58.12,26.91 STM-HD2.1 | STM-USART.1 63.38,88.95 63.38,88 62.88,87.5 55.62,87.5 v53.12,85 53.12,77.88 52.88,77.62 49.25,77.62 49,77.88 | v49,78.88 49,77.88 | v39.88,85.25 39.88,81.12 43.38,77.62 48.75,77.62 49,77.88
  Bottom 1.016: DCDC-3.5V.OUTP#2 38.67,86.45 v39.88,85.25
VESP
  Top 0.406: ESP8266.CH_PD ESP-C1.1 | ESP-GPIO0.1 73.46,1 65.25,1 63.75,2.5 63.75,4.5 63.5,4.75 63.5,5.16 ESP8266.VCC 63.61,5.38 60.88,5.38 59.5,4 ESP-VDD.2
  Top 0.61: ESP8266.CH_PD 65.66,8.16 63.75,6.25 63.75,5.41 ESP8266.VCC
VEXT
  Top 0.406: ESP-UART-A.1 81.62,7.32 81.62,1.38 80.5,0.25 64.29,0.25 ESP-VDD.3